# Altium schematic sheet p10_HDMI.SchDoc
size 386 x 246 mm
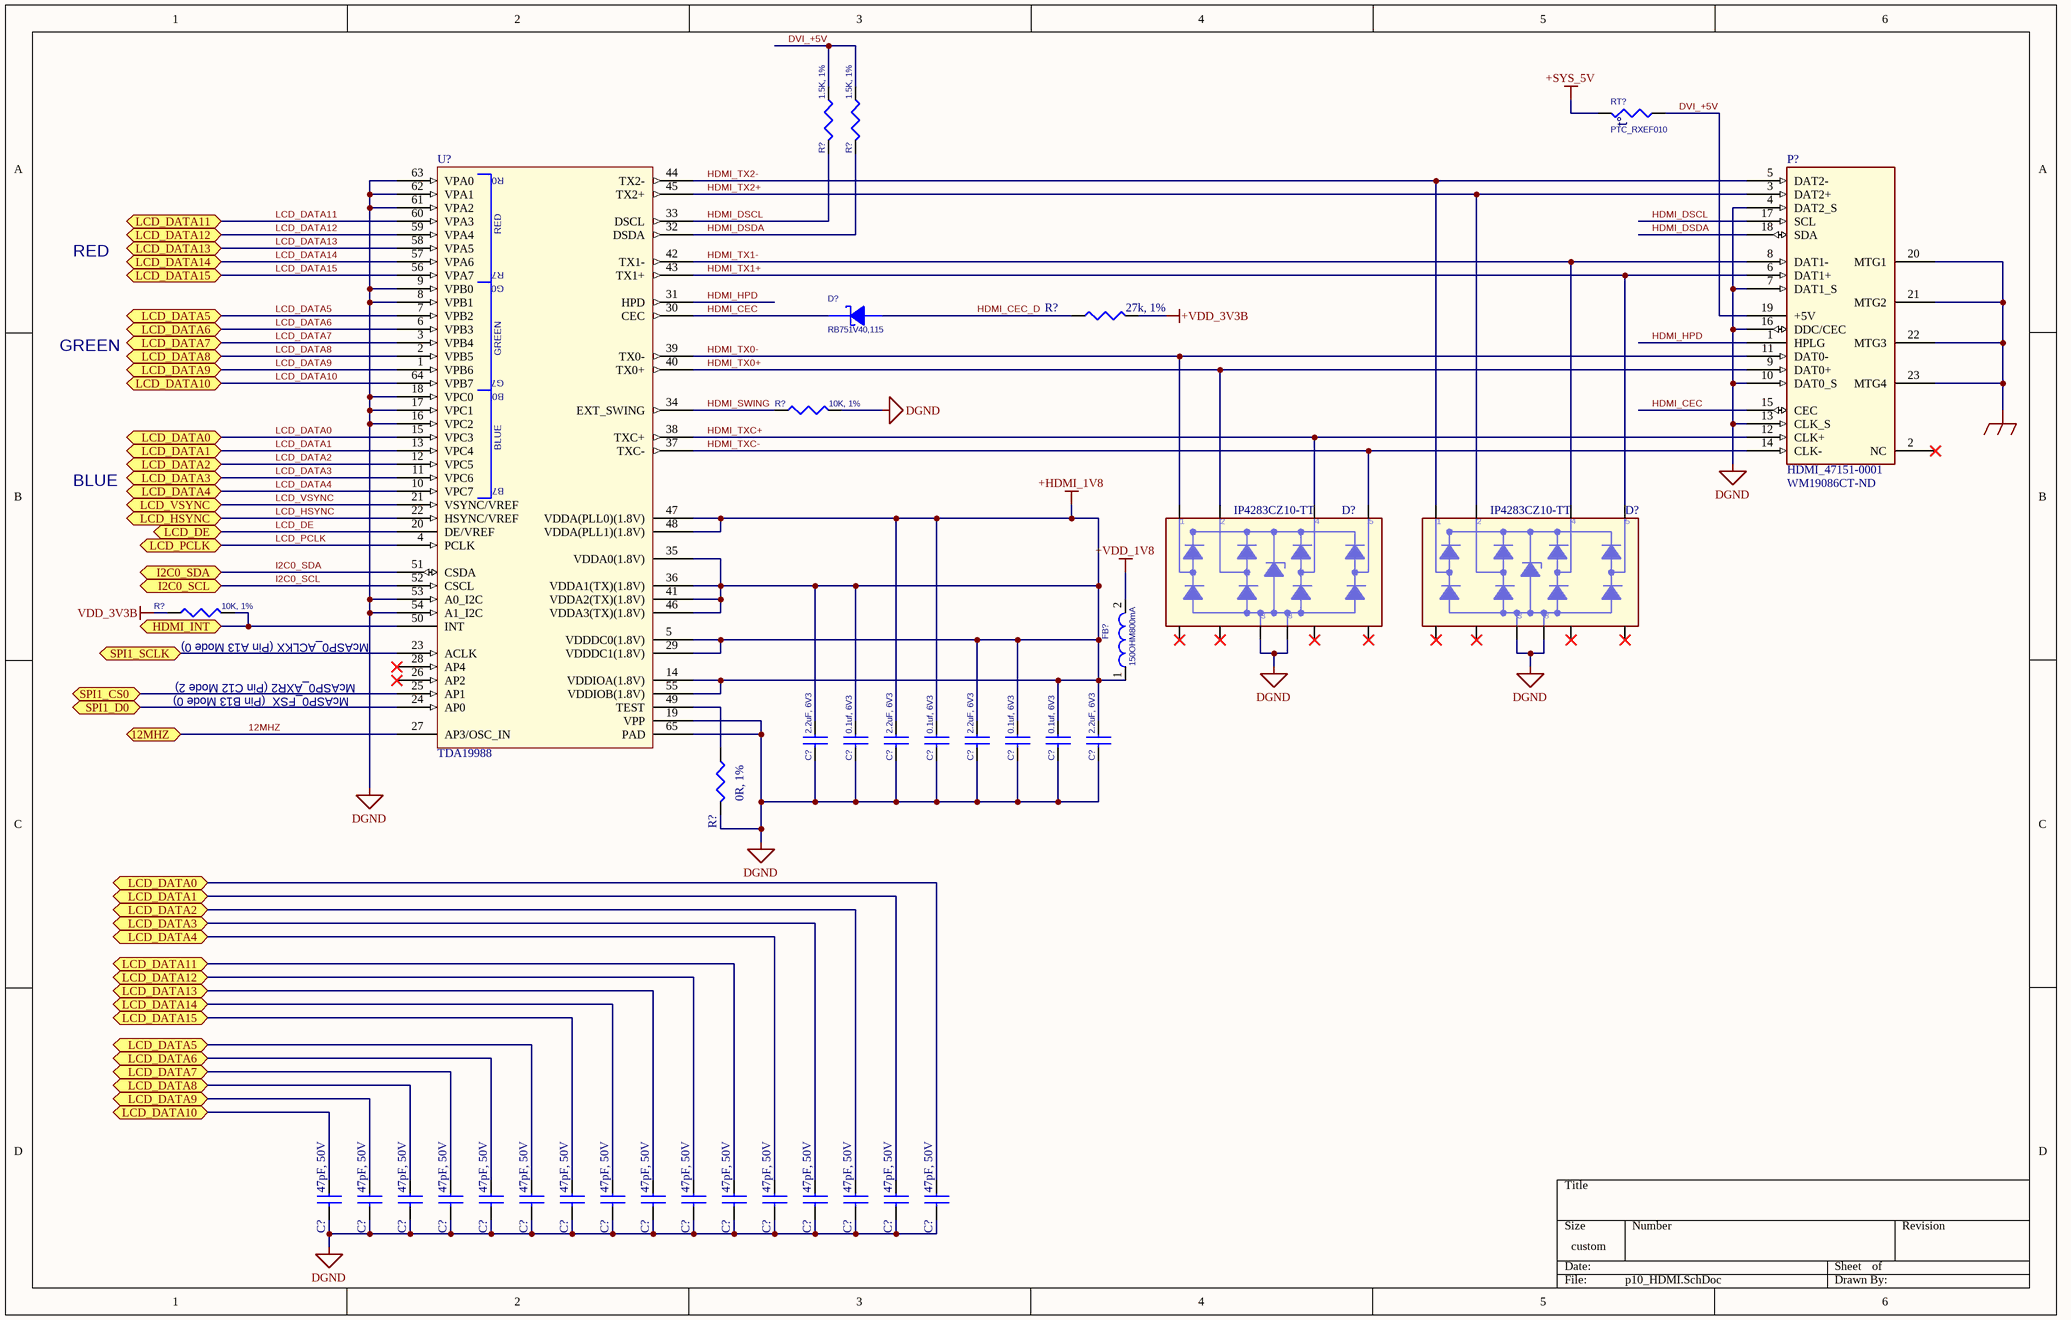
[diagram p0: p10_HDMI.SchDoc]

## Parts
(Parts that share a designator on the sheet are numbered #1, #2 ... from top to bottom, then left to right.)
C?#1  2.2uF, 6V3  [402]
C?#2  0.1uf, 6V3  [402]
C?#3  2.2uF, 6V3  [402]
C?#4  0.1uf, 6V3  [402]
C?#5  2.2uF, 6V3  [402]
C?#6  0.1uf, 6V3  [402]
C?#7  0.1uf, 6V3  [402]
C?#8  2.2uF, 6V3  [402]
C?#9  47pF, 50V  [402]
C?#10  47pF, 50V  [402]
C?#11  47pF, 50V  [402]
C?#12  47pF, 50V  [402]
C?#13  47pF, 50V  [402]
C?#14  47pF, 50V  [402]
C?#15  47pF, 50V  [402]
C?#16  47pF, 50V  [402]
C?#17  47pF, 50V  [402]
C?#18  47pF, 50V  [402]
C?#19  47pF, 50V  [402]
C?#20  47pF, 50V  [402]
C?#21  47pF, 50V  [402]
C?#22  47pF, 50V  [402]
C?#23  47pF, 50V  [402]
C?#24  47pF, 50V  [402]
D?#1  RB751V40,115  [SOD323]
D?#2  IP4283CZ10-TT  [TSSOP10]
D?#3  IP4283CZ10-TT  [TSSOP10]
FB?  150OHM800mA  [SM-7351-IND-0805]
P?  HDMI_47151-0001  Supplier Part Number 1: WM19086CT-ND  [HDMI]
R?#1  1.5K, 1%  [402]
R?#2  1.5K, 1%  [402]
R?#3  27k, 1%  [402]
R?#4  10K, 1%  [402]
R?#5  10K, 1%  [402]
R?#6  0R, 1%  [402]
RT?  PTC_RXEF010  [POLYSW200-5638-310]
U?  TDA19988  [QFN64S9X9P5]

## Ports
12MHZ, HDMI_INT, I2C0_SCL, I2C0_SDA, LCD_DATA0, LCD_DATA1, LCD_DATA2, LCD_DATA3, LCD_DATA4, LCD_DATA5, LCD_DATA6, LCD_DATA7, LCD_DATA8, LCD_DATA9, LCD_DATA10, LCD_DATA11, LCD_DATA12, LCD_DATA13, LCD_DATA14, LCD_DATA15, LCD_DE, LCD_HSYNC, LCD_PCLK, LCD_VSYNC, SPI1_CS0, SPI1_D0, SPI1_SCLK

## Nets
+HDMI_1V8: C?#1.1 C?#2.1 C?#3.1 C?#4.1 C?#5.1 C?#6.1 C?#7.1 C?#8.1 FB?.1 U?.5(VDDDC0(1.8V)) U?.14(VDDIOA(1.8V)) U?.29(VDDDC1(1.8V)) U?.35(VDDA0(1.8V)) U?.36(VDDA1(TX)(1.8V)) U?.41(VDDA2(TX)(1.8V)) U?.46(VDDA3(TX)(1.8V)) U?.47(VDDA(PLL0)(1.8V)) U?.48(VDDA(PLL1)(1.8V)) U?.55(VDDIOB(1.8V))
+SYS_5V: RT?.1(P1)
+VDD_1V8: FB?.2
+VDD_3V3B: R?#3.2
DGND: C?#1.2 C?#2.2 C?#3.2 C?#4.2 C?#5.2 C?#6.2 C?#7.2 C?#8.2 C?#9.2 C?#10.2 C?#11.2 C?#12.2 C?#13.2 C?#14.2 C?#15.2 C?#16.2 C?#17.2 C?#18.2 C?#19.2 C?#20.2 C?#21.2 C?#22.2 C?#23.2 C?#24.2 D?#2.3 D?#2.8 D?#3.3 D?#3.8 P?.4(DAT2_S) P?.7(DAT1_S) P?.10(DAT0_S) P?.13(CLK_S) P?.16(DDC/CEC) R?#4.2 R?#6.2 U?.8(VPB1) U?.9(VPB0) U?.16(VPC2) U?.17(VPC1) U?.18(VPC0) U?.19(VPP) U?.53(A0_I2C) U?.54(A1_I2C) U?.61(VPA2) U?.62(VPA1) U?.63(VPA0) U?.65(PAD)
GND_EARTH: P?.20(MTG1) P?.21(MTG2) P?.22(MTG3) P?.23(MTG4)
VDD_3V3B: R?#5.1
12MHZ: U?.27(AP3/OSC_IN) ; port 12MHZ
DVI_+5V: P?.19(+5V) R?#1.1 R?#2.1 RT?.2(P2)
HDMI_CEC: D?#1.1(C) P?.15(CEC) U?.30(CEC)
HDMI_CEC_D: D?#1.2(A) R?#3.1
HDMI_DSCL: P?.17(SCL) R?#1.2 U?.33(DSCL)
HDMI_DSDA: P?.18(SDA) R?#2.2 U?.32(DSDA)
HDMI_HPD: P?.1(HPLG) U?.31(HPD)
HDMI_INT: R?#5.2 U?.50(INT) ; port HDMI_INT
HDMI_SWING: R?#4.1 U?.34(EXT_SWING)
HDMI_TX0+: D?#2.2 P?.9(DAT0+) U?.40(TX0+)
HDMI_TX0-: D?#2.1 P?.11(DAT0-) U?.39(TX0-)
HDMI_TX1+: D?#3.5 P?.6(DAT1+) U?.43(TX1+)
HDMI_TX1-: D?#3.4 P?.8(DAT1-) U?.42(TX1-)
HDMI_TX2+: D?#3.2 P?.3(DAT2+) U?.45(TX2+)
HDMI_TX2-: D?#3.1 P?.5(DAT2-) U?.44(TX2-)
HDMI_TXC+: D?#2.4 P?.12(CLK+) U?.38(TXC+)
HDMI_TXC-: D?#2.5 P?.14(CLK-) U?.37(TXC-)
I2C0_SCL: U?.52(CSCL) ; port I2C0_SCL
I2C0_SDA: U?.51(CSDA) ; port I2C0_SDA
LCD_DATA0: C?#24.1 U?.15(VPC3) ; port LCD_DATA0
LCD_DATA1: C?#23.1 U?.13(VPC4) ; port LCD_DATA1
LCD_DATA2: C?#22.1 U?.12(VPC5) ; port LCD_DATA2
LCD_DATA3: C?#21.1 U?.11(VPC6) ; port LCD_DATA3
LCD_DATA4: C?#20.1 U?.10(VPC7) ; port LCD_DATA4
LCD_DATA5: C?#14.1 U?.7(VPB2) ; port LCD_DATA5
LCD_DATA6: C?#13.1 U?.6(VPB3) ; port LCD_DATA6
LCD_DATA7: C?#12.1 U?.3(VPB4) ; port LCD_DATA7
LCD_DATA8: C?#11.1 U?.2(VPB5) ; port LCD_DATA8
LCD_DATA9: C?#10.1 U?.1(VPB6) ; port LCD_DATA9
LCD_DATA10: C?#9.1 U?.64(VPB7) ; port LCD_DATA10
LCD_DATA11: C?#19.1 U?.60(VPA3) ; port LCD_DATA11
LCD_DATA12: C?#18.1 U?.59(VPA4) ; port LCD_DATA12
LCD_DATA13: C?#17.1 U?.58(VPA5) ; port LCD_DATA13
LCD_DATA14: C?#16.1 U?.57(VPA6) ; port LCD_DATA14
LCD_DATA15: C?#15.1 U?.56(VPA7) ; port LCD_DATA15
LCD_DE: U?.20(DE/VREF) ; port LCD_DE
LCD_HSYNC: U?.22(HSYNC/VREF) ; port LCD_HSYNC
LCD_PCLK: U?.4(PCLK) ; port LCD_PCLK
LCD_VSYNC: U?.21(VSYNC/VREF) ; port LCD_VSYNC
SPI1_CS0: U?.25(AP1) ; port SPI1_CS0
SPI1_D0: U?.24(AP0) ; port SPI1_D0
SPI1_SCLK: U?.23(ACLK) ; port SPI1_SCLK
NetR?#6_1: R?#6.1 U?.49(TEST)

Not connected (* = marked no-connect by the designer): D?#2 6* 7* 9* 10*; D?#3 6* 7* 9* 10*; P? 2(NC)*; U? 26(AP2)* 28(AP4)*

## Notes on the sheet
- RED
- GREEN
- BLUE
- (near R?#5) McASP0_ACLKX (Pin A13 Mode 0)
- McASP0_FSX  (Pin B13 Mode 0)
- McASP0_AXR2 (Pin C12 Mode 2)
- (in symbol PTC) t°
- (in symbol TDA19988) R0; RED; R7; G0; GREEN; G7; B0; BLUE; B7

## Library data of the parts
C?#1 C?#3 C?#5 C?#8 = CAP_2.2uF_X5R_6.3V_10%_0402: CAP CER 2.2UF 6.3V 10% X5R 0402; Manufacturer: TDK Corporation; Manufacturer Part Number: C1005X5R0J225K050BC; Capacitance: 2.2µF; Supplier 1: Digi-Key; Supplier Part Number 1: 445-6847-6-ND; RoHS: RoHS Compliant; Category: Capacitors; Stock 1: 47221; Pricing 1: 1=0.24, 10=0.2, 100=0.1, 250=0.075, 500=0.06626, 1000=0.05875, 5000=0.04875 (USD); Voltage - Rated: 6.3V; Tolerance: ±10%; Temperature Coefficient: X5R; Mounting Type: Surface Mount, MLCC; Operating Temperature: -55°C ~ 85°C; Applications: General Purpose; Ratings: -; Package / Case: 0402 (1005 Metric); Size / Dimension: 0.039" L x 0.020" W (1.00mm x 0.50mm); Height - Seated (Max): -; Thickness (Max): 0.022" (0.55mm); Lead Spacing: -; Features: -; Packaging: Digi-Reel®; Lead Style: -; ComponentLink1URL: http://product.tdk.com/capacitor/mlcc/en/documents/mlcc_commercial_general_en.pdf; ComponentLink1Description: http://product.tdk.com/capacitor/mlcc/en/documents/mlcc_commercial_general_en.pdf
C?#2 C?#4 C?#6 C?#7 = CAP_0.1uF_X7R_16V_10% 0402: CAP CER 0.1UF 6.3V 10% X5R 0402; Manufacturer: TDK Corporation; Manufacturer Part Number: C1005X5R0J104K050BA; Capacitance: 0.1µF; Applications: General Purpose; Category: Capacitors; ComponentLink1Description: http://www.kemet.com/datasheets&C0402C104K4RACTU; ComponentLink1URL: http://www.kemet.com/datasheets&C0402C104K4RACTU; Features: -; Height - Seated (Max): -; Lead Spacing: -; Lead Style: -; Mounting Type: Surface Mount, MLCC; Operating Temperature: -55°C ~ 85°C; Package / Case: 0402 (1005 Metric); Packaging: Digi-Reel®; Pricing 1: 1=0.1, 10=0.026, 100=0.0121, 250=0.00992, 500=0.00848, 1000=0.0066, 5000=0.0055 (USD); Ratings: -; RoHS: RoHS Compliant; Size / Dimension: 0.039" L x 0.020" W (1.00mm x 0.50mm); Stock 1: 127604; Supplier 1: Digi-Key; Supplier Part Number 1: 445-1266-6-ND; Temperature Coefficient: X5R; Thickness (Max): 0.022" (0.55mm); Tolerance: ±10%; Voltage - Rated: 6.3V
C?#9-C?#24 = CAP_47PF_COG_50V_5%_0402: CAP CER 47PF 50V 5% NP0 0402; Manufacturer: TDK Corporation; Manufacturer Part Number: C1005C0G1H470J050BA; Temperature Coefficient: C0G, NP0; Supplier 1: Digi-Key; RoHS: RoHS Compliant; Category: Capacitors; Stock 1: 596222; Pricing 1: 1=0.1, 10=0.024, 100=0.011, 250=0.009, 500=0.0077, 1000=0.006, 5000=0.005 (USD); Packaging: Cut Tape (CT); Capacitance: 47pF; Voltage - Rated: 50V; Tolerance: ±5%; Mounting Type: Surface Mount, MLCC; Operating Temperature: -55°C ~ 125°C; Applications: General Purpose; Ratings: -; Package/Case: 0402 (1005 Metric); Size / Dimension: 0.039" L x 0.020" W (1.00mm x 0.50mm); Height - Seated (Max): -; Thickness (Max): 0.022" (0.55mm); Lead Spacing: -; Features: -; Lead Style: -; ComponentLink1URL: http://product.tdk.com/capacitor/mlcc/en/documents/mlcc_commercial_general_en.pdf; ComponentLink1Description: http://product.tdk.com/capacitor/mlcc/en/documents/mlcc_commercial_general_en.pdf; Supplier Part Number 1: 445-1243-1-ND
D?#1 = Zener: DIODE SCHOTTKY 40V 120MA SOD323; Manufacturer: NXP Semiconductors; Current - Average Rectified (Io): 120mA (DC); Voltage - Forward (Vf) (Max) @ If: 370mV @ 1mA; Speed: Small Signal =< 200mA (Io), Any Speed; Current - Reverse Leakage @ Vr: 500nA @ 30V; Capacitance @ Vr, F: 2pF @ 1V, 1MHz; Supplier 1: Digi-Key; Supplier Part Number 1: 568-8119-6-ND; Manufacturer Part Number: RB751V40,115; RoHS: RoHS Compliant; Category: Discrete Semiconductor Products; Stock 1: 5326; Pricing 1: 1=0.29, 10=0.26, 25=0.1872, 100=0.1456, 250=0.09152, 500=0.07798, 1000=0.05313 (USD); Diode Type: Schottky; Voltage - DC Reverse (Vr) (Max): 40V; Reverse Recovery Time (trr): -; Mounting Type: Surface Mount; Package / Case: SC-76, SOD-323; Supplier Device Package: SOD-323; Packaging: Digi-Reel®; ComponentLink1URL: http://www.nxp.com/documents/data_sheet/RB751_SER.pdf; ComponentLink1Description: http://www.nxp.com/documents/data_sheet/RB751_SER.pdf
D?#2 D?#3 = 32CTQ030/TO_1: DIODE ESD PROT HDMI 10TSSOP; Manufacturer: NXP Semiconductors; Manufacturer Part Number: IP4283CZ10-TT,118; Voltage - Reverse Standoff (Typ): 3V; Voltage - Breakdown: 6V; Polarization: 4 Channel Array - Unidirectional; Supplier 1: Digi-Key; Supplier Part Number 1: 568-5875-6-ND; RoHS: RoHS Compliant; Category: Circuit Protection; Stock 1: 1067; Pricing 1: 1=0.85, 10=0.743, 25=0.6568, 100=0.5724, 250=0.49828, 500=0.42416, 1000=0.33974 (USD); Power (Watts): -; Mounting Type: Surface Mount; Package / Case: 10-TFSOP, 10-MSOP (0.118", 3.00mm Width); Supplier Device Package: 10-TSSOP; Packaging: Digi-Reel®; ComponentLink1URL: http://media.digikey.com/pdf/Data%20Sheets/NXP%20PDFs/IP4283CZ10.pdf; ComponentLink1Description: http://media.digikey.com/pdf/Data%20Sheets/NXP%20PDFs/IP4283CZ10.pdf
FB? = IND: FERRITE 800MA 150 OHM 0805 SMD; Manufacturer: Laird-Signal Integrity Products; Manufacturer Part Number: LI0805H151R-10; Impedance @ Frequency: 150 Ohm @ 100MHz; DC Resistance (DCR): 150 mOhm Max; Filter Type: Differential Mode - Single; Supplier 1: Digi-Key; Supplier Part Number 1: 240-2384-6-ND; RoHS: RoHS Compliant; Category: Filters; Stock 1: 10144; Pricing 1: 1=0.1, 10=0.07, 25=0.064, 50=0.0574, 100=0.0421, 250=0.03064, 500=0.02808, 1000=0.02424 (USD); Current Rating: 800mA; Package / Case: 0805 (2012 Metric); Mounting Type: Surface Mount; Packaging: Digi-Reel®; Height (Max): 0.043" (1.10mm); Size / Dimension: 0.079" L x 0.049" W (2.00mm x 1.25mm); ComponentLink1URL: http://www.lairdtech.com/WorkArea/linkit.aspx?LinkIdentifier=id&ItemID=4912; ComponentLink1Description: http://www.lairdtech.com/WorkArea/linkit.aspx?LinkIdentifier=id&ItemID=4912
P? = HDMI_47151-0001: CONN RCPT 19POS HDMI RT ANG SMD; Manufacturer: Molex Inc; Manufacturer Part Number: 0471510001; Number of Contacts: 19; Gender: Receptacle; Supplier 1: Digi-Key; RoHS: RoHS Compliant; Category: Connectors, Interconnects; Stock 1: 6388; Pricing 1: 1=2.57, 10=2.332, 25=2.1888, 50=2.0938, 100=1.9986 (USD); Packaging: Cut Tape (CT); Connector Type: HDMI; Specifications: -; Mounting Type: Surface Mount, Right Angle, Horizontal; Features: Detent Lock; Ingress Protection: -; ComponentLink1URL: http://www.molex.com/pdm_docs/sd/471510001_sd.pdf; ComponentLink1Description: http://www.molex.com/pdm_docs/sd/471510001_sd.pdf
R?#1 R?#2 = RES_1.5K_1/16W_5%_0402: RES 1.50K OHM 1/16W 1% 0402 SMD; Manufacturer: Yageo; Manufacturer Part Number: RC0402FR-071K5L; Power (Watts): 0.063W, 1/16W; Temperature Coefficient: ±100ppm/°C; Supplier 1: Digi-Key; Supplier Part Number 1: 311-1.50KLRDKR-ND; RoHS: RoHS Compliant; Category: Resistors; Stock 1: 465266; Pricing 1: 1=0.1, 10=0.014, 25=0.0104, 100=0.0063, 250=0.0054, 500=0.00382, 1000=0.0027, 2500=0.00234, 5000=0.00203 (USD); Resistance (Ohms): 1.5k; Composition: Thick Film; Features: -; Tolerance: ±1%; Package / Case: 0402 (1005 Metric); Supplier Device Package: 0402; Size / Dimension: 0.039" L x 0.020" W (1.00mm x 0.50mm); Height: 0.016" (0.40mm); Number of Terminations: 2; Packaging: Digi-Reel®; ComponentLink1URL: http://www.yageo.com/documents/recent/PYu-RC0402_51_RoHS_L_6.pdf; ComponentLink1Description: http://www.yageo.com/documents/recent/PYu-RC0402_51_RoHS_L_6.pdf
R?#3 = RES_27K_1/16W_1%_0402: RES 27K OHM 1/16W 1% 0402 SMD; Manufacturer: Yageo; Manufacturer Part Number: RC0402FR-0727KL; Power (Watts): 0.063W, 1/16W; Temperature Coefficient: ±100ppm/°C; Supplier 1: Digi-Key; RoHS: RoHS Compliant; Category: Resistors; Stock 1: 270424; Pricing 1: 1=0.1, 10=0.014, 25=0.0104, 100=0.0063, 250=0.0054, 500=0.00382, 1000=0.0027, 2500=0.00234, 5000=0.00203 (USD); Packaging: Cut Tape (CT); Resistance (Ohms): 27k; Tolerance: ±1%; Composition: Thick Film; Features: -; Package/Case: 0402 (1005 Metric); Supplier Device Package: 0402; Size / Dimension: 0.039" L x 0.020" W (1.00mm x 0.50mm); Height: 0.016" (0.40mm); Number of Terminations: 2; ComponentLink1URL: http://www.yageo.com/documents/recent/PYu-RC0402_51_RoHS_L_6.pdf; ComponentLink1Description: http://www.yageo.com/documents/recent/PYu-RC0402_51_RoHS_L_6.pdf; Supplier Part Number 1: 311-27.0KLRCT-ND
R?#4 R?#5 = RES_10K_1/16W_1%_0402: RES 10K OHM 1/16W 5% 0402 SMD; Manufacturer: Rohm Semiconductor; Manufacturer Part Number: MCR01MZPJ103; Power (Watts): 0.063W, 1/16W; Temperature Coefficient: ±200ppm/°C; Supplier 1: Digi-Key; Supplier Part Number 1: RHM10KJDKR-ND; RoHS: RoHS Compliant; Category: Resistors; Stock 1: 110842; Pricing 1: 1=0.1, 10=0.019, 25=0.014, 100=0.0078, 250=0.00596, 500=0.00476, 1000=0.0035, 5000=0.00251 (USD); Resistance (Ohms): 10k; Composition: Thick Film; Features: Automotive AEC-Q200 Qualified; Tolerance: ±5%; Package / Case: 0402 (1005 Metric); Supplier Device Package: 0402 (1005 Metric); Size / Dimension: 0.039" L x 0.020" W (1.00mm x 0.50mm); Height: 0.016" (0.40mm); Number of Terminations: 2; Packaging: Digi-Reel®; ComponentLink1URL: http://rohmfs.rohm.com/en/products/databook/datasheet/passive/resistor/chip_resistor/mcr_a.pdf; ComponentLink1Description: http://rohmfs.rohm.com/en/products/databook/datasheet/passive/resistor/chip_resistor/mcr_a.pdf
R?#6 = RES_0_1/16W_1%_0402: RES 0.0 OHM 1/16W 0402 SMD; Manufacturer: Yageo; Manufacturer Part Number: RC0402JR-070RL; Power (Watts): 0.063W, 1/16W; Resistance (Ohms): 0.0; Tolerance: Jumper; Category: Resistors; ComponentLink1Description: http://www.yageo.com/documents/recent/PYu-RC0402_51_RoHS_L_6.pdf; ComponentLink1URL: http://www.yageo.com/documents/recent/PYu-RC0402_51_RoHS_L_6.pdf; Composition: Thick Film; Features: -; Height: 0.016" (0.40mm); Number of Terminations: 2; Package / Case: 0402 (1005 Metric); Packaging: Digi-Reel®; Pricing 1: 1=0.1, 10=0.012, 25=0.0092, 100=0.0055, 250=0.00476, 500=0.00336, 1000=0.00237, 2500=0.00206, 5000=0.00178 (USD); RoHS: RoHS Compliant; Size / Dimension: 0.039" L x 0.020" W (1.00mm x 0.50mm); Stock 1: 4904429; Supplier 1: Digi-Key; Supplier Device Package: 0402; Supplier Part Number 1: 311-0.0JRDKR-ND; Temperature Coefficient: -
RT? = PTC: POLYSWITCH PTC RESET 0.1A; Manufacturer: TE Connectivity; Current - Hold (Ih) (Max): 100mA; Current - Trip (It): 200mA; Current - Max: 40A; Voltage - Max: 60V; R Min/Max: 2.500 ~ 4.500 Ohm; Time to Trip: 4s; Supplier 1: Digi-Key; Supplier Part Number 1: RXEF010-ND; Manufacturer Part Number: RXEF010; RoHS: RoHS Compliant; Category: Circuit Protection; Stock 1: 22325; Pricing 1: 1=0.32, 10=0.289, 100=0.2625, 500=0.20476, 1000=0.1764, 5000=0.1617, 10000=0.1365, 50000=0.13125, 100000=0.126 (USD); Package / Case: Radial, Disc; Packaging: Bulk; ComponentLink1URL: http://documents.tycoelectronics.com/commerce/DocumentDelivery/DDEController?Action=showdoc&DocId=Specification+Or+Standard%7FSCD25213%7FE%7Fpdf%7FEnglish%7FENG_SS_SCD25213_E.pdf; ComponentLink1Description: http://documents.tycoelectronics.com/commerce/DocumentDelivery/DDEController?Action=showdoc&DocId=Specification+Or+Standard%7FSCD25213%7FE%7Fpdf%7FEnglish%7FENG_SS_SCD25213_E.pdf
U? = TDA19988: IC HDMI TRANSMITTER 64-HVQFN; Manufacturer: NXP Semiconductors; Manufacturer Part Number: TDA19988AHN/C1,551; Supplier 1: Digi-Key; Supplier Part Number 1: TDA19988AHN/C1,551-ND; RoHS: RoHS Compliant; Category: Integrated Circuits (ICs); Stock 1: 0; Pricing 1: 260=4.59 (USD); Type: HDMI Transmitter; Applications: Set-Top Boxes; Mounting Type: Surface Mount; Package / Case: 64-VFQFN Exposed Pad; Supplier Device Package: 64-HVQFN (9x9); Packaging: Tray